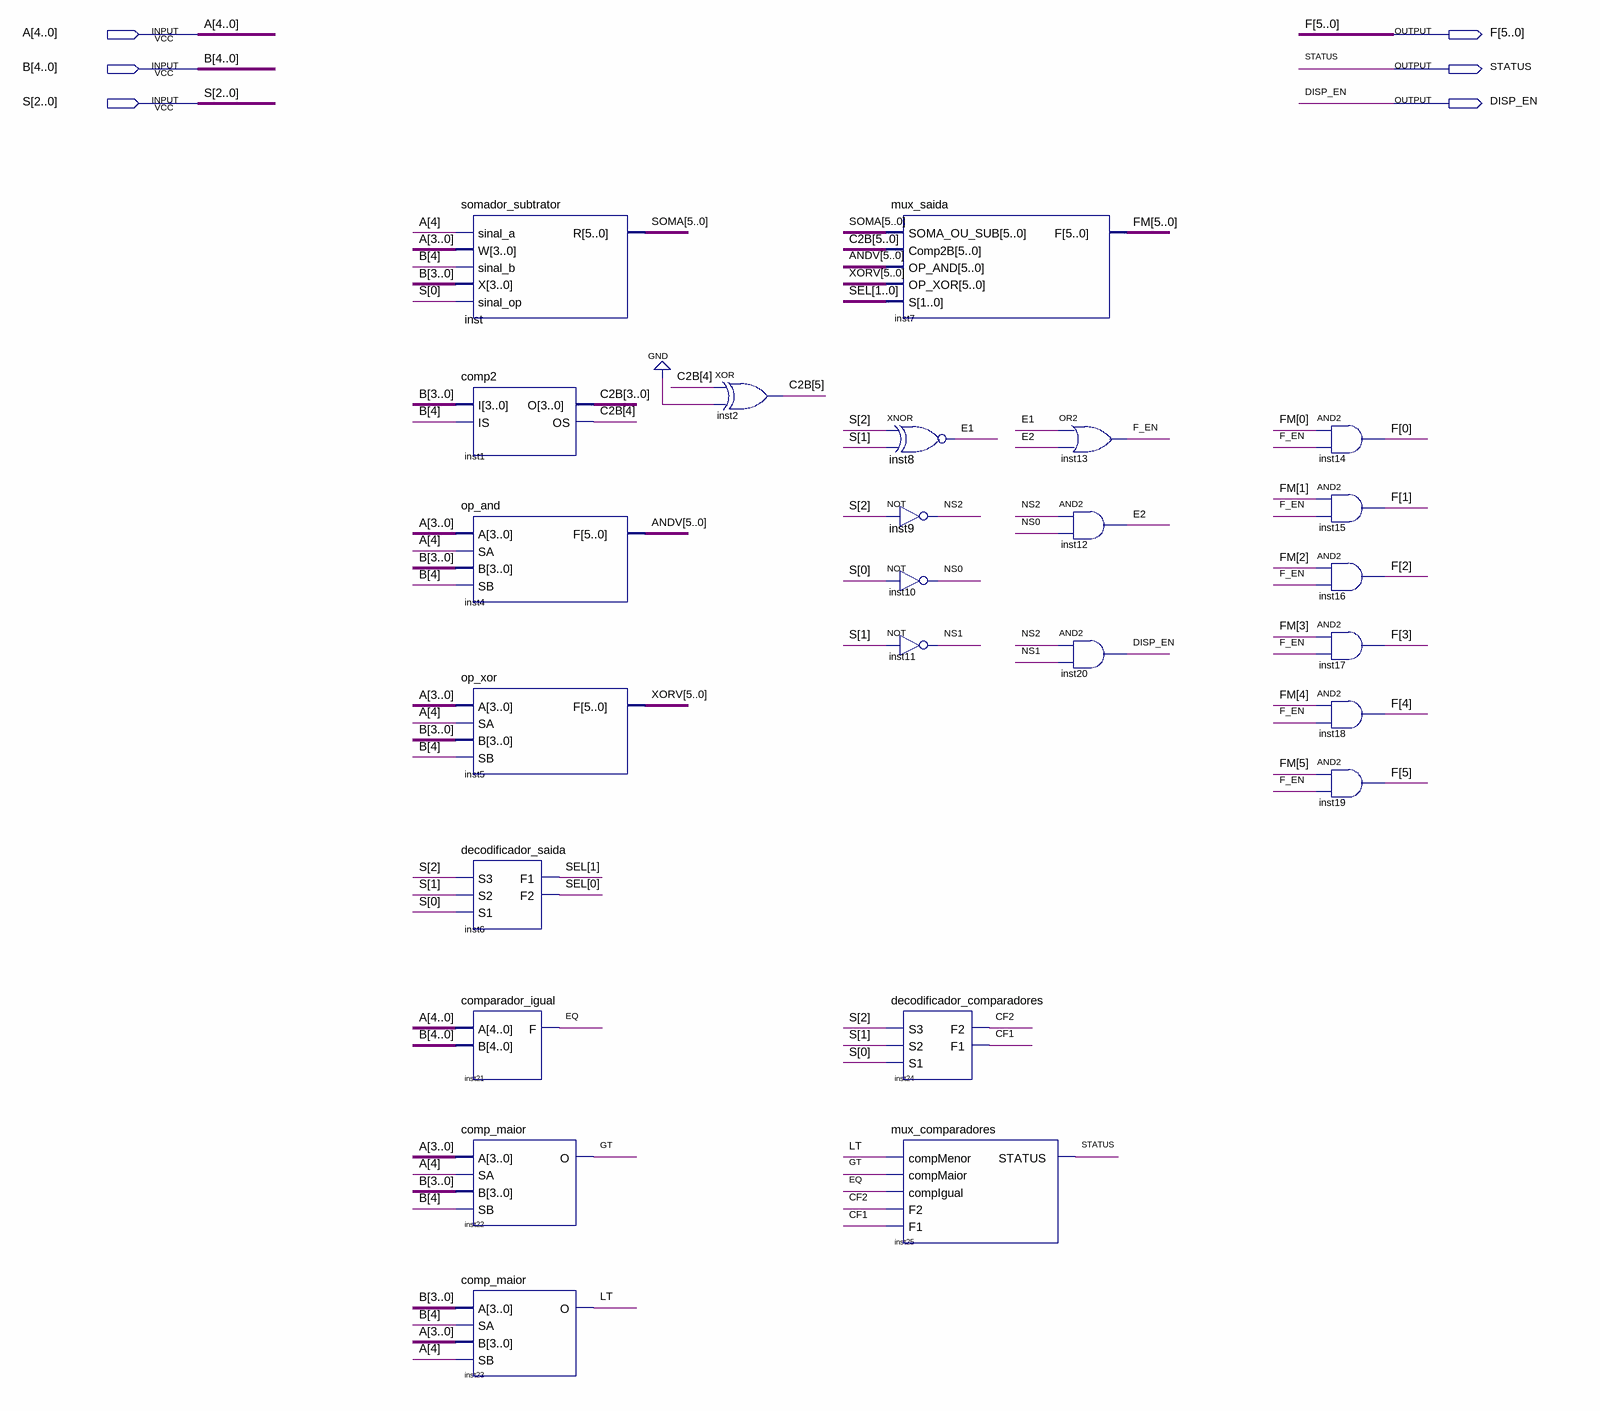
[diagram p0: schematic sheet]
// Quartus schematic ula.bdf as structural Verilog: 25 symbols, 6 pins
module ula (
  input  [4:0] A,
  input  [4:0] B,
  input  [2:0] S,
  output [5:0] F,
  output STATUS,
  output DISP_EN
);

  wire CF1, CF2, E1, E2, EQ, F_EN, GT, LT, NS0, NS1, NS2;
  wire [1:0] SEL;
  wire [5:0] ANDV, C2B, FM, SOMA, XORV;

  somador_subtrator inst (.sinal_a(A[4]), .W(A[3:0]), .sinal_b(B[4]), .X(B[3:0]), .sinal_op(S[0]), .R(SOMA));
  comp2 inst1 (.I(B[3:0]), .IS(B[4]), .O(C2B[3:0]), .OS(C2B[4]));
  op_and inst4 (.A(A[3:0]), .SA(A[4]), .B(B[3:0]), .SB(B[4]), .F(ANDV));
  op_xor inst5 (.A(A[3:0]), .SA(A[4]), .B(B[3:0]), .SB(B[4]), .F(XORV));
  decodificador_saida inst6 (.S3(S[2]), .S2(S[1]), .S1(S[0]), .F1(SEL[1]), .F2(SEL[0]));
  comparador_igual inst21 (.A(A), .B(B), .F(EQ));
  comp_maior inst22 (.A(A[3:0]), .SA(A[4]), .B(B[3:0]), .SB(B[4]), .O(GT));
  comp_maior inst23 (.A(B[3:0]), .SA(B[4]), .B(A[3:0]), .SB(A[4]), .O(LT));
  xor inst2 (C2B[5], C2B[4], 1'b0);
  mux_saida inst7 (.SOMA_OU_SUB(SOMA), .Comp2B(C2B), .OP_AND(ANDV), .OP_XOR(XORV), .S(SEL), .F(FM));
  xnor inst8 (E1, S[2], S[1]);
  not inst9 (NS2, S[2]);
  not inst10 (NS0, S[0]);
  not inst11 (NS1, S[1]);
  decodificador_comparadores inst24 (.S3(S[2]), .S2(S[1]), .S1(S[0]), .F2(CF2), .F1(CF1));
  mux_comparadores inst25 (.compMenor(LT), .compMaior(GT), .compIgual(EQ), .F2(CF2), .F1(CF1), .STATUS(STATUS));
  or inst13 (F_EN, E1, E2);
  and inst12 (E2, NS2, NS0);
  and inst20 (DISP_EN, NS2, NS1);
  and inst14 (F[0], FM[0], F_EN);
  and inst15 (F[1], FM[1], F_EN);
  and inst16 (F[2], FM[2], F_EN);
  and inst17 (F[3], FM[3], F_EN);
  and inst18 (F[4], FM[4], F_EN);
  and inst19 (F[5], FM[5], F_EN);
endmodule
